# Altium schematic sheet Camera_Board.SchDoc
size A4
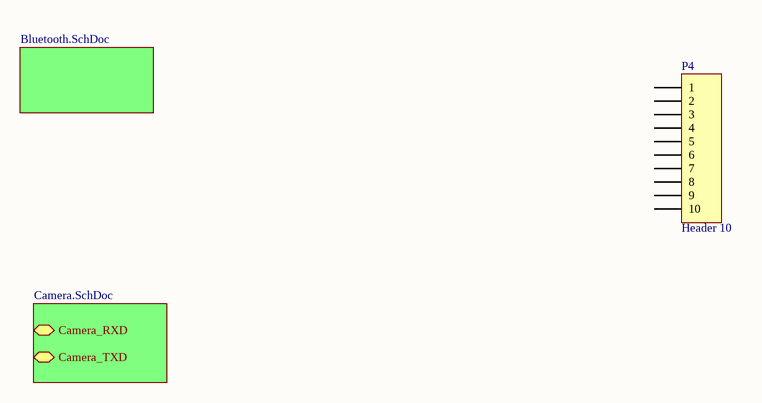
[diagram p0: Camera_Board.SchDoc]

## Parts
P4  Header 10  [HDR1X10]

## Sub-sheets
? = Bluetooth.SchDoc: no entries
? = Camera.SchDoc: Camera_RXD, Camera_TXD

## Nets

Not connected (* = marked no-connect by the designer): P4 1 2 3 4 5 6 7 8 9 10

## Library data of the parts
P4 = Header 10: Header, 10-Pin; LatestRevisionDate: 17-Jul-2002; LatestRevisionNote: Re-released for DXP Platform.; Publisher: Altium Limited